# EAGLE schematic WeatherStation (EAGLE 7.5.0)
CNAME: Gabor Simon
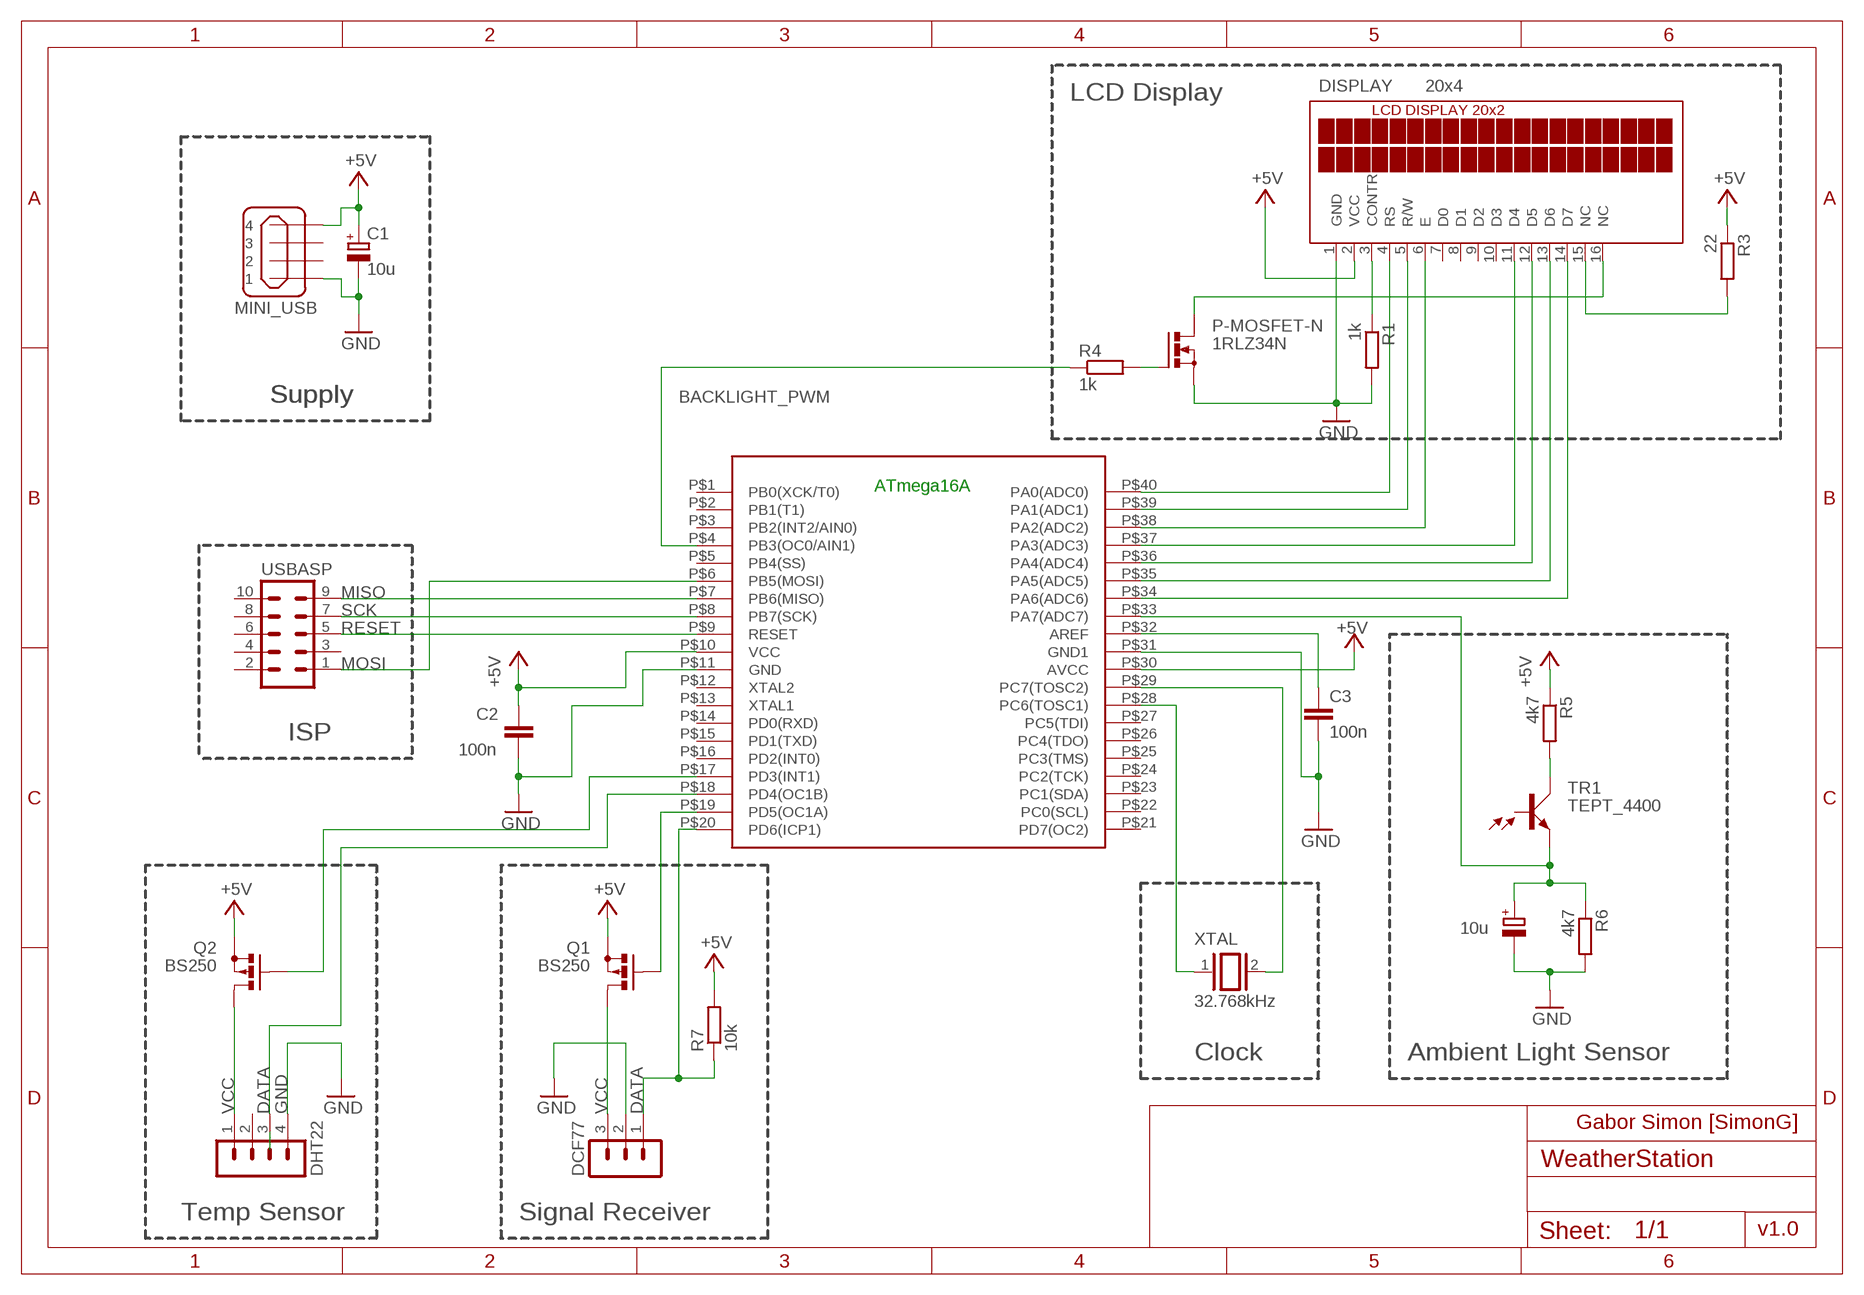
[diagram p0: schematic, sheet 1]

## Parts
ATMEGA_16A  ATMEGA_16A  ATMEGA16LTHROUGHHOLE  [ATMEL_ATMEGA16]
C1  10u  CPOL-EUE5-8.5  [E5-8,5]
C2  100n  C-EU025-024X044  [C025-024X044]
C3  100n  C-EU025-024X044  [C025-024X044]
C4  10u  CPOL-EUE5-8.5  [E5-8,5]
DCF77  MA03-1  [MA03-1]
DHT22  MA04-1  [MA04-1]
DISPLAY  20x4  TUXGR_20X2  [TUXGR_20X2]
MINI_USB  MINI USB  MINI-USB_4P-85-32004-10X  [85-32004-10X]
P-MOSFET-N  1RLZ34N  PMOSFET_NTO220BH  [TO220BH]
Q1  BS250  [SOT54E]
Q2  BS250  [SOT54E]
R1  1k  R-EU_0204/7  [0204/7]
R3  22  R-EU_0204/7  [0204/7]
R4  1k  R-EU_0204/7  [0204/7]
R5  4k7  R-EU_0204/7  [0204/7]
R6  4k7  R-EU_0204/7  [0204/7]
R7  10k  R-EU_0204/7  [0204/7]
TR1  TEPT_4400  BP103  [BP103]
USBASP  MA05-2  [MA05-2]
XTAL  32.768kHz  XTAL  [Q]

## Nets
+5V: ATMEGA_16A.P$10(VCC) ATMEGA_16A.P$30(AVCC) C1.+ C2.1 DISPLAY.2(VCC) MINI_USB.4 Q1.S Q2.S R3.1 R5.1 R7.2
BACKLIGHT_PWM: ATMEGA_16A.P$4(PB3(OC0/AIN1)) R4.1
DATA: ATMEGA_16A.P$18(PD4(OC1B)) ATMEGA_16A.P$20(PD6(ICP1)) DCF77.1 DHT22.3 R7.1
GND: ATMEGA_16A.P$11(GND) ATMEGA_16A.P$31(GND1) C1.- C2.2 C3.2 C4.- DCF77.2 DHT22.4 DISPLAY.1(GND) MINI_USB.1 P-MOSFET-N.S R1.2 R6.2
LED+: DISPLAY.15(NC) R3.2
LED-: DISPLAY.16(NC) P-MOSFET-N.D
MISO: ATMEGA_16A.P$7(PB6(MISO)) USBASP.9
MOSI: ATMEGA_16A.P$6(PB5(MOSI)) USBASP.1
N$1: ATMEGA_16A.P$38(PA2(ADC2)) DISPLAY.6(E)
N$2: ATMEGA_16A.P$39(PA1(ADC1)) DISPLAY.5(R/W)
N$3: ATMEGA_16A.P$40(PA0(ADC0)) DISPLAY.4(RS)
N$4: ATMEGA_16A.P$34(PA6(ADC6)) DISPLAY.14(D7)
N$5: ATMEGA_16A.P$35(PA5(ADC5)) DISPLAY.13(D6)
N$6: ATMEGA_16A.P$36(PA4(ADC4)) DISPLAY.12(D5)
N$7: ATMEGA_16A.P$37(PA3(ADC3)) DISPLAY.11(D4)
N$8: ATMEGA_16A.P$32(AREF) C3.1
N$9: ATMEGA_16A.P$28(PC6(TOSC1)) XTAL.1
N$10: ATMEGA_16A.P$29(PC7(TOSC2)) XTAL.2
N$11: ATMEGA_16A.P$17(PD3(INT1)) Q2.G
N$12: ATMEGA_16A.P$33(PA7(ADC7)) C4.+ R6.1 TR1.E
N$18: R5.2 TR1.C
N$20: ATMEGA_16A.P$19(PD5(OC1A)) Q1.G
N$21: DISPLAY.3(CONTR) R1.1
N$28: P-MOSFET-N.G R4.2
RESET: ATMEGA_16A.P$9(RESET) USBASP.5
SCK: ATMEGA_16A.P$8(PB7(SCK)) USBASP.7
VCC: DCF77.3 DHT22.1 Q1.D Q2.D
Unconnected: ATMEGA_16A.P$1(PB0(XCK/T0)) ATMEGA_16A.P$2(PB1(T1)) ATMEGA_16A.P$3(PB2(INT2/AIN0)) ATMEGA_16A.P$5(PB4(SS)) ATMEGA_16A.P$12(XTAL2) ATMEGA_16A.P$13(XTAL1) ATMEGA_16A.P$14(PD0(RXD)) ATMEGA_16A.P$15(PD1(TXD)) ATMEGA_16A.P$16(PD2(INT0)) ATMEGA_16A.P$21(PD7(OC2)) ATMEGA_16A.P$22(PC0(SCL)) ATMEGA_16A.P$23(PC1(SDA)) ATMEGA_16A.P$24(PC2(TCK)) ATMEGA_16A.P$25(PC3(TMS)) ATMEGA_16A.P$26(PC4(TDO)) ATMEGA_16A.P$27(PC5(TDI)) DHT22.2 DISPLAY.7(D0) DISPLAY.8(D1) DISPLAY.9(D2) DISPLAY.10(D3) MINI_USB.2 MINI_USB.3 TR1.B USBASP.2 USBASP.3 USBASP.4 USBASP.6 USBASP.8 USBASP.10

## Notes on the sheet
- LCD Display
- Supply | Supply
- ATmega16A
- ISP
- Clock | Ambient Light Sensor
- Gabor Simon [SimonG]
- Temp Sensor | Signal Receiver | v1.0

## Library data of the parts
ATMEGA_16A = atmega16l:ATMEGA16L
C1 C4 = rcl:CPOL-EU: POLARIZED CAPACITOR, European symbol
C2 C3 = resistor:C-EU: CAPACITOR, European symbol
DCF77 = con-lstb:MA03-1: PIN HEADER; OC_FARNELL: unknown; OC_NEWARK: unknown
DHT22 = con-lstb:MA04-1: PIN HEADER; OC_FARNELL: unknown; OC_NEWARK: unknown
DISPLAY = display-lcd:TUXGR_20X2: Tuxgraphics LCD display 20x2 characters reflective, without background light Source: tuxgr_20x2.pdf; OC_FARNELL: unknown; OC_NEWARK: unknown
MINI_USB = con-cypressindustries:MINI-USB_4P-: MINI USB 4 Pol. Source: www.cypressindustries.com; OC_FARNELL: unknown; OC_NEWARK: unknown
P-MOSFET-N = transistor-power:PMOSFET_N: Power MOSFET N-Channel
Q1 Q2 = transistor-small-signal:BS250: P-CHANNEL MOS FET
R1 R3-R7 = rcl:R-EU_: RESISTOR, European symbol
TR1 = opto-trans-siemens:BP103: PHOTO TRANSISTOR; OC_FARNELL: unknown; OC_NEWARK: unknown
USBASP = con-lstb:MA05-2: PIN HEADER; OC_FARNELL: unknown; OC_NEWARK: unknown
XTAL = special:XTAL: CRYSTAL